# EAGLE schematic PATHS 1.1 (EAGLE 6.5.0)
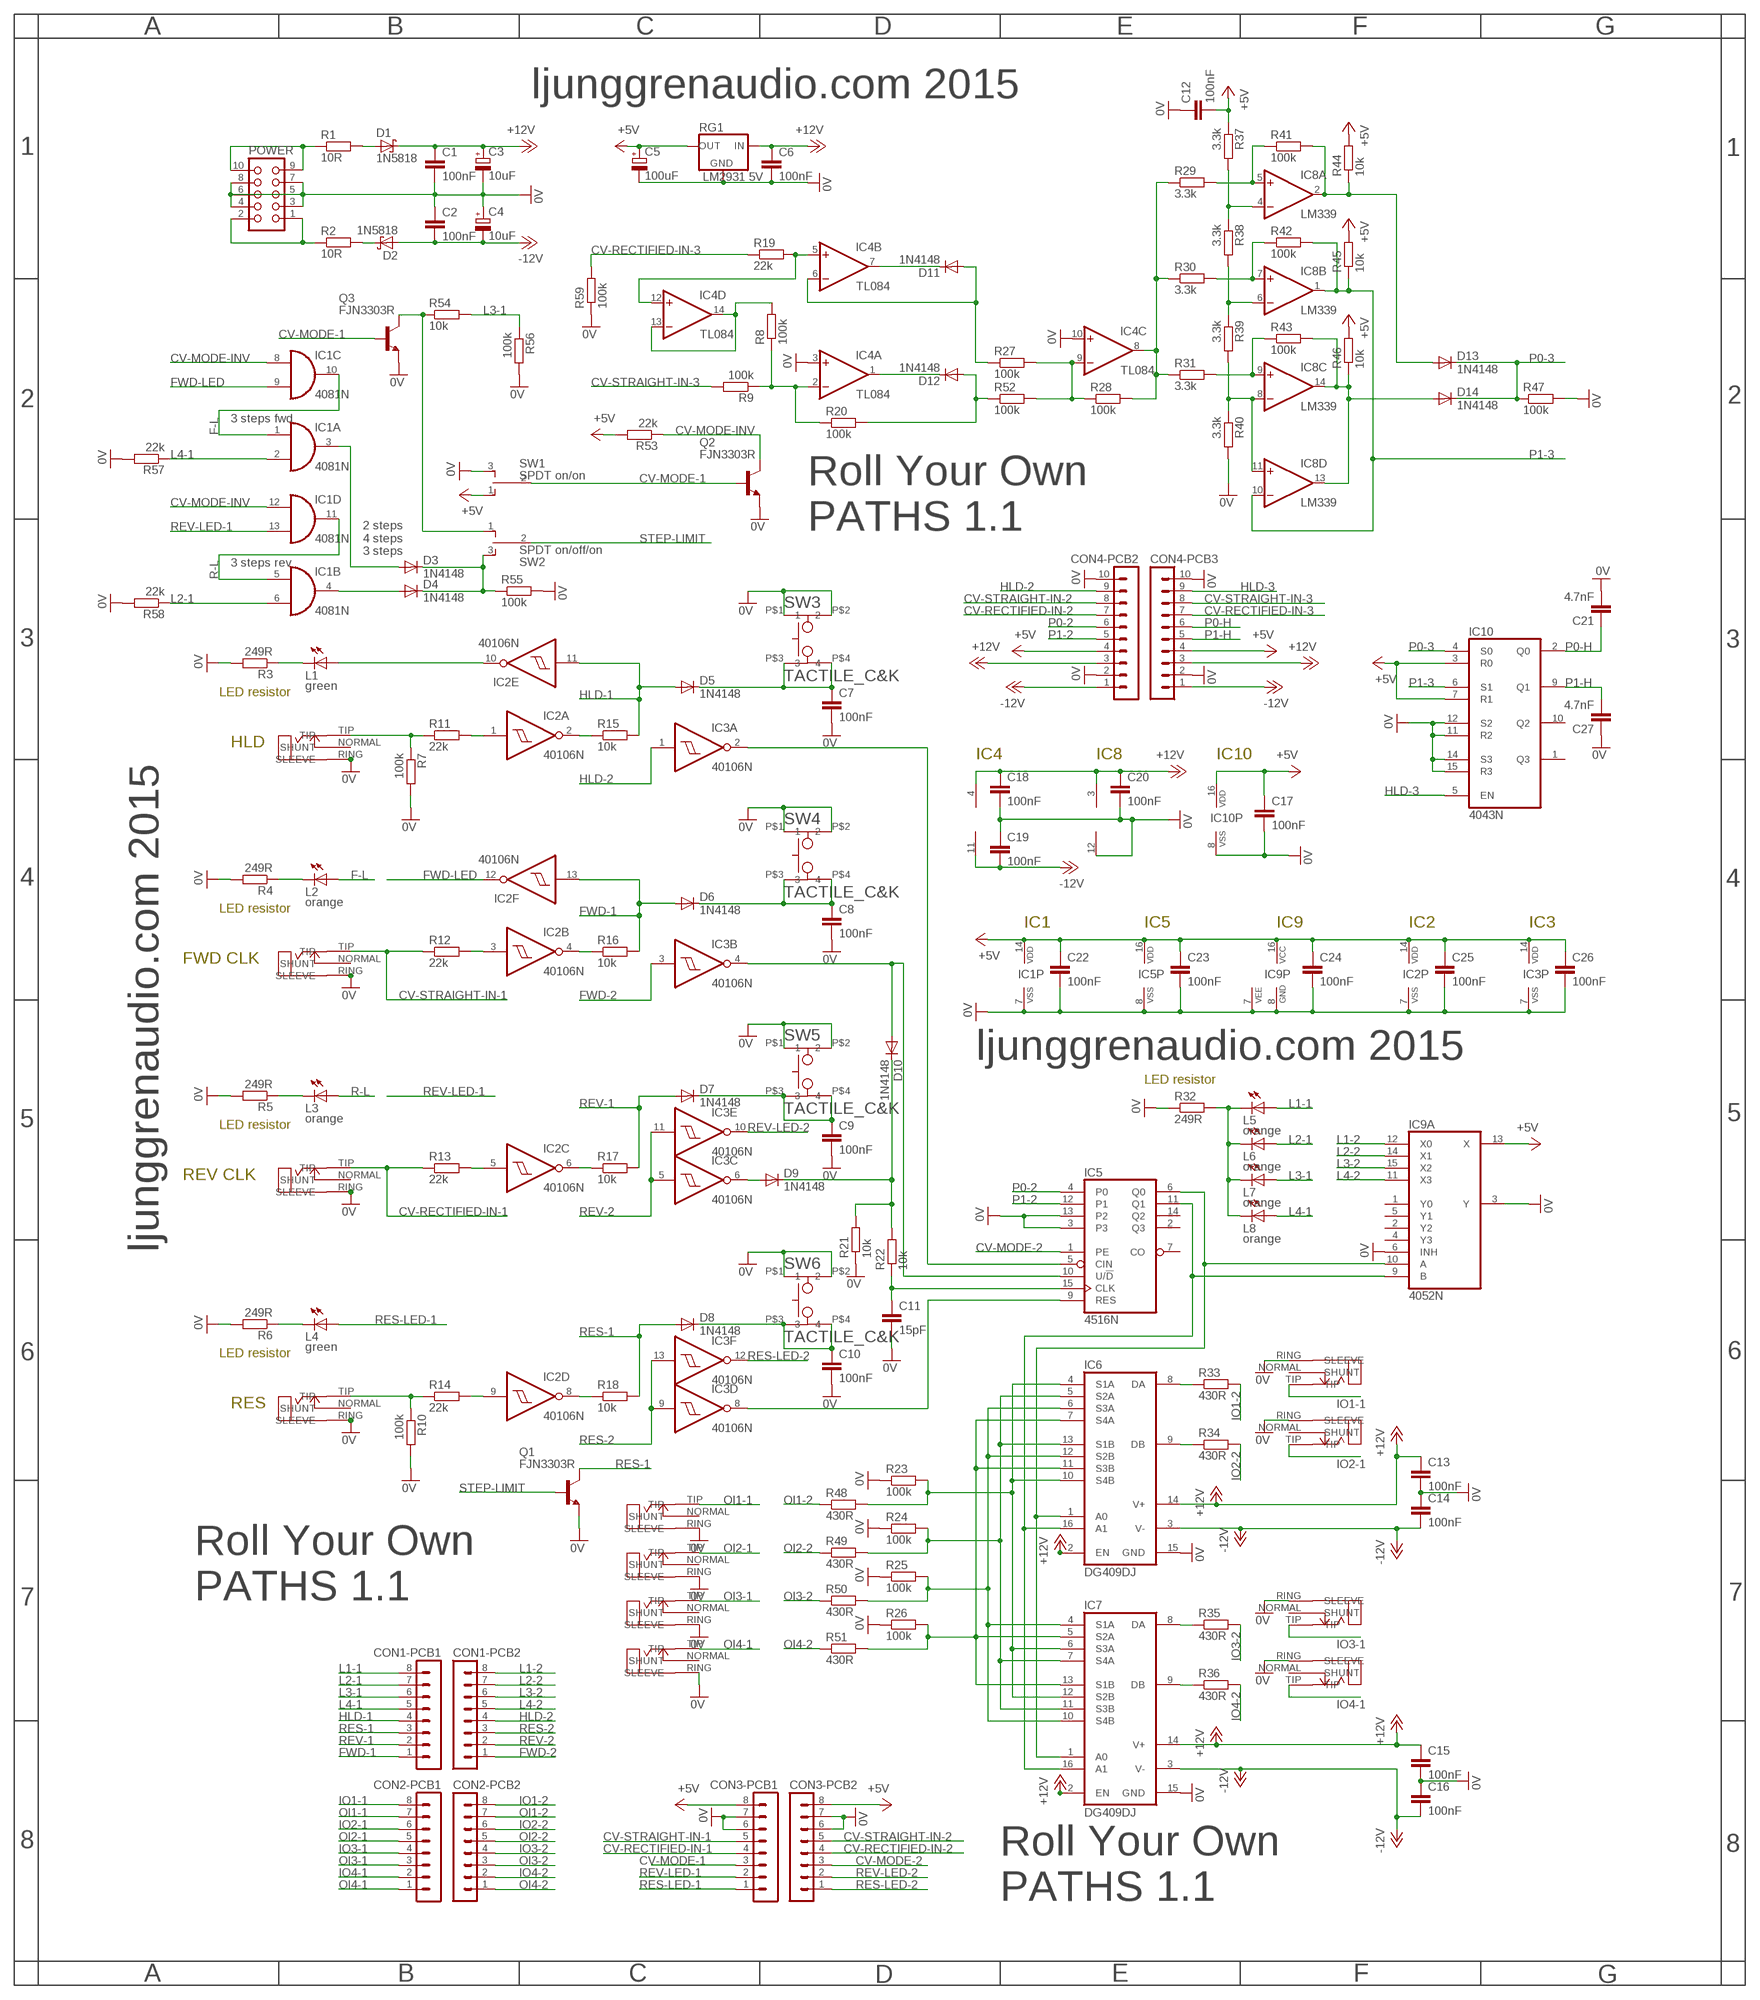
[diagram p0: schematic, sheet 1]

## Parts
C1  100nF  C-EU025-024X044  [C025-024X044]
C2  100nF  C-EU025-024X044  [C025-024X044]
C3  10uF  CPOL-EUE2-5  [E2-5]
C4  10uF  CPOL-EUE2-5  [E2-5]
C5  100uF  CPOL-EUE2.5-6  [E2,5-6]
C6  100nF  C-EU025-024X044  [C025-024X044]
C7  100nF  C-EU025-024X044  [C025-024X044]
C8  100nF  C-EU025-024X044  [C025-024X044]
C9  100nF  C-EU025-024X044  [C025-024X044]
C10  100nF  C-EU025-024X044  [C025-024X044]
C11  15pF  C-EU025-024X044  [C025-024X044]
C12  100nF  C-EU025-024X044  [C025-024X044]
C13  100nF  C-EU025-024X044  [C025-024X044]
C14  100nF  C-EU025-024X044  [C025-024X044]
C15  100nF  C-EU025-024X044  [C025-024X044]
C16  100nF  C-EU025-024X044  [C025-024X044]
C17  100nF  C-EU025-024X044  [C025-024X044]
C18  100nF  C-EU025-024X044  [C025-024X044]
C19  100nF  C-EU025-024X044  [C025-024X044]
C20  100nF  C-EU025-024X044  [C025-024X044]
C21  4.7nF  C-EU025-024X044  [C025-024X044]
C22  100nF  C-EU025-024X044  [C025-024X044]
C23  100nF  C-EU025-024X044  [C025-024X044]
C24  100nF  C-EU025-024X044  [C025-024X044]
C25  100nF  C-EU025-024X044  [C025-024X044]
C26  100nF  C-EU025-024X044  [C025-024X044]
C27  4.7nF  C-EU025-024X044  [C025-024X044]
CON1-PCB1  MA08-1  [MA08-1]
CON1-PCB2  MA08-1  [MA08-1]
CON2-PCB1  MA08-1  [MA08-1]
CON2-PCB2  MA08-1  [MA08-1]
CON3-PCB1  MA08-1  [MA08-1]
CON3-PCB2  MA08-1  [MA08-1]
CON4-PCB2  MA10-1  [MA10-1]
CON4-PCB3  MA10-1  [MA10-1]
D1  1N5818  SB130DO-204AL  [DO41-7]
D2  1N5818  SB130DO-204AL  [DO41-7]
D3  1N4148  1N4148DO35-6  [DO35-6]
D4  1N4148  1N4148DO35-6  [DO35-6]
D5  1N4148  1N4148DO35-6  [DO35-6]
D6  1N4148  1N4148DO35-6  [DO35-6]
D7  1N4148  1N4148DO35-6  [DO35-6]
D8  1N4148  1N4148DO35-6  [DO35-6]
D9  1N4148  1N4148DO35-6  [DO35-6]
D10  1N4148  1N4148DO35-6  [DO35-6]
D11  1N4148  1N4148DO35-6  [DO35-6]
D12  1N4148  1N4148DO35-6  [DO35-6]
D13  1N4148  1N4148DO35-6  [DO35-6]
D14  1N4148  1N4148DO35-6  [DO35-6]
FWD  ERTHENVAR_3.5MM_JACKINLINE2  [THONKICON-TWISTED]
HLD  ERTHENVAR_3.5MM_JACKINLINE2  [THONKICON-TWISTED]
I/O1  ERTHENVAR_3.5MM_JACKINLINE2  [THONKICON-TWISTED]
I/O2  ERTHENVAR_3.5MM_JACKINLINE2  [THONKICON-TWISTED]
I/O3  ERTHENVAR_3.5MM_JACKINLINE2  [THONKICON-TWISTED]
I/O4  ERTHENVAR_3.5MM_JACKINLINE2  [THONKICON-TWISTED]
IC1  4081N  [DIL14]
IC2  40106N  [DIL14]
IC3  40106N  [DIL14]
IC4  TL084  TL074P  [DIL14]
IC5  4516N  [DIL16]
IC6  DG409DJ  [DIL16]
IC7  DG409DJ  [DIL16]
IC8  LM339  LM2901N  [DIL14]
IC9  4052N  [DIL16]
IC10  4043N  [DIL16]
L1  green  LED3MM  [LED3MM]
L2  orange  LED3MM  [LED3MM]
L3  orange  LED3MM  [LED3MM]
L4  green  LED3MM  [LED3MM]
L5  orange  LED3MM  [LED3MM]
L6  orange  LED3MM  [LED3MM]
L7  orange  LED3MM  [LED3MM]
L8  orange  LED3MM  [LED3MM]
O/I1  ERTHENVAR_3.5MM_JACKINLINE2  [THONKICON-TWISTED]
O/I2  ERTHENVAR_3.5MM_JACKINLINE2  [THONKICON-TWISTED]
O/I3  ERTHENVAR_3.5MM_JACKINLINE2  [THONKICON-TWISTED]
O/I4  ERTHENVAR_3.5MM_JACKINLINE2  [THONKICON-TWISTED]
POWER  CON10L  [CON10L]
Q1  FJN3303R  [TO92-LINE]
Q2  FJN3303R  [TO92-LINE]
Q3  FJN3303R  [TO92-LINE]
R1  10R  R-EU_0207/10  [0207/9]
R2  10R  R-EU_0207/10  [0207/9]
R3  249R  R-EU_0204/5  [0204/5]
R4  249R  R-EU_0204/5  [0204/5]
R5  249R  R-EU_0204/5  [0204/5]
R6  249R  R-EU_0204/5  [0204/5]
R7  100k  R-EU_0204/5  [0204/5]
R8  100k  R-EU_0204/5  [0204/5]
R9  100k  R-EU_0204/5  [0204/5]
R10  100k  R-EU_0204/5  [0204/5]
R11  22k  R-EU_0204/5  [0204/5]
R12  22k  R-EU_0204/5  [0204/5]
R13  22k  R-EU_0204/5  [0204/5]
R14  22k  R-EU_0204/5  [0204/5]
R15  10k  R-EU_0204/5  [0204/5]
R16  10k  R-EU_0204/5  [0204/5]
R17  10k  R-EU_0204/5  [0204/5]
R18  10k  R-EU_0204/5  [0204/5]
R19  22k  R-EU_0204/5  [0204/5]
R20  100k  R-EU_0204/5  [0204/5]
R21  10k  R-EU_0204/5  [0204/5]
R22  10k  R-EU_0204/5  [0204/5]
R23  100k  R-EU_0204/5  [0204/5]
R24  100k  R-EU_0204/5  [0204/5]
R25  100k  R-EU_0204/5  [0204/5]
R26  100k  R-EU_0204/5  [0204/5]
R27  100k  R-EU_0204/5  [0204/5]
R28  100k  R-EU_0204/5  [0204/5]
R29  3.3k  R-EU_0204/5  [0204/5]
R30  3.3k  R-EU_0204/5  [0204/5]
R31  3.3k  R-EU_0204/5  [0204/5]
R32  249R  R-EU_0204/5  [0204/5]
R33  430R  R-EU_0207/10  [0207/9]
R34  430R  R-EU_0207/10  [0207/9]
R35  430R  R-EU_0207/10  [0207/9]
R36  430R  R-EU_0207/10  [0207/9]
R37  3.3k  R-EU_0204/5  [0204/5]
R38  3.3k  R-EU_0204/5  [0204/5]
R39  3.3k  R-EU_0204/5  [0204/5]
R40  3.3k  R-EU_0204/5  [0204/5]
R41  100k  R-EU_0204/5  [0204/5]
R42  100k  R-EU_0204/5  [0204/5]
R43  100k  R-EU_0204/5  [0204/5]
R44  10k  R-EU_0204/5  [0204/5]
R45  10k  R-EU_0204/5  [0204/5]
R46  10k  R-EU_0204/5  [0204/5]
R47  100k  R-EU_0204/5  [0204/5]
R48  430R  R-EU_0207/10  [0207/9]
R49  430R  R-EU_0207/10  [0207/9]
R50  430R  R-EU_0207/10  [0207/9]
R51  430R  R-EU_0207/10  [0207/9]
R52  100k  R-EU_0204/5  [0204/5]
R53  22k  R-EU_0204/5  [0204/5]
R54  10k  R-EU_0204/5  [0204/5]
R55  100k  R-EU_0204/5  [0204/5]
R56  100k  R-EU_0204/5  [0204/5]
R57  22k  R-EU_0204/5  [0204/5]
R58  22k  R-EU_0204/5  [0204/5]
R59  100k  R-EU_0204/5  [0204/5]
RES  ERTHENVAR_3.5MM_JACKINLINE2  [THONKICON-TWISTED]
REV  ERTHENVAR_3.5MM_JACKINLINE2  [THONKICON-TWISTED]
RG1  LM2931 5V  78LXXLM2931XXX  [TO92-LINE]
SW1  SPDT on/on  SPDTTOP-SUBMINI  [SPDT-HORIZONTAL-TOP-SUBMINI-MULTICOMP]
SW2  SPDT on/off/on  SPDTTOP-SUBMINI  [SPDT-HORIZONTAL-TOP-SUBMINI-MULTICOMP]
SW3  TACTILE_C&K  [TACTILE_CK]
SW4  TACTILE_C&K  [TACTILE_CK]
SW5  TACTILE_C&K  [TACTILE_CK]
SW6  TACTILE_C&K  [TACTILE_CK]

## Nets
0V: C1.2 C2.1 C3.- C4.+ C5.- C6.2 C7.2 C8.2 C9.2 C10.2 C11.2 C12.1 C13.2 C14.1 C15.2 C16.1 C17.2 C18.2 C19.1 C20.2 C21.2 C22.2 C23.2 C24.2 C25.2 C26.2 C27.1 CON3-PCB1.6 CON3-PCB1.7 CON3-PCB2.6 CON3-PCB2.7 CON4-PCB2.2 CON4-PCB2.10 CON4-PCB3.2 CON4-PCB3.10 FWD.RING(SLEEVE) HLD.RING(SLEEVE) I/O1.RING(SLEEVE) I/O2.RING(SLEEVE) I/O3.RING(SLEEVE) I/O4.RING(SLEEVE) IC1.7(P:VSS) IC2.7(P:VSS) IC3.7(P:VSS) IC4.3(A:+IN) IC4.10(C:+IN) IC5.3 IC5.8(VSS) IC5.13(P2) IC6.15(GND) IC7.15(GND) IC8.12(P:V-) IC9.3(A:Y) IC9.6(A:INH) IC9.7(P:VEE) IC9.8(P:GND) IC10.8(VSS) IC10.11(R2) IC10.12(S2) IC10.14(S3) IC10.15(R3) O/I1.RING(SLEEVE) O/I2.RING(SLEEVE) O/I3.RING(SLEEVE) O/I4.RING(SLEEVE) POWER.3 POWER.4 POWER.5 POWER.6 POWER.7 POWER.8 Q1.3(E) Q2.3(E) Q3.3(E) R3.2 R4.2 R5.2 R6.2 R7.2 R10.2 R21.1 R23.1 R24.1 R25.1 R26.1 R32.1 R40.2 R47.2 R55.2 R56.2 R57.2 R58.2 R59.1 RES.RING(SLEEVE) REV.RING(SLEEVE) RG1.2(GND) SW1.3 SW3.P$1 SW3.P$2 SW4.P$1 SW4.P$2 SW5.P$1 SW5.P$2 SW6.P$1 SW6.P$2
+5V: C5.+ C12.2 C17.1 C22.1 C23.1 C24.1 C25.1 C26.1 CON3-PCB1.8 CON3-PCB2.8 CON4-PCB2.4 CON4-PCB3.4 IC1.14(P:VDD) IC2.14(P:VDD) IC3.14(P:VDD) IC5.16(VDD) IC9.13(A:X) IC9.16(P:VCC) IC10.3(R0) IC10.7(R1) IC10.16(VDD) R37.1 R44.2 R45.2 R46.2 R53.2 RG1.3(OUT) SW1.1
+12V: C1.1 C3.+ C6.1 C13.1 C15.1 C18.1 C20.1 CON4-PCB2.3 CON4-PCB3.3 D1.C IC4.4(P:V+) IC6.2(EN) IC6.14(V+) IC7.2(EN) IC7.14(V+) IC8.3(P:V+) RG1.1(IN)
-12V: C2.2 C4.- C14.2 C16.2 C19.2 CON4-PCB2.1 CON4-PCB3.1 D2.A IC4.11(P:V-) IC6.3(V-) IC7.3(V-)
BDF3R2T: C9.1 D7.CATHODE(C) SW5.P$3 SW5.P$4
CV-MODE-1: CON3-PCB1.3 Q2.1(B) Q3.1(B) SW1.2
CV-MODE-2: CON3-PCB2.3 IC5.1(PE)
CV-MODE-INV: IC1.8(C:I0) IC1.12(D:I0) Q2.2(C) R53.1
CV-RECTIFIED-IN-1: CON3-PCB1.4 R13.1 REV.TIP
CV-RECTIFIED-IN-2: CON3-PCB2.4 CON4-PCB2.7
CV-RECTIFIED-IN-3: CON4-PCB3.7 R19.1 R59.2
CV-STRAIGHT-IN-1: CON3-PCB1.5 FWD.TIP R12.1
CV-STRAIGHT-IN-2: CON3-PCB2.5 CON4-PCB2.8
CV-STRAIGHT-IN-3: CON4-PCB3.8 R9.2
DFGT43: C8.1 D6.CATHODE(C) SW4.P$3 SW4.P$4
DVW4D: D9.ANODE(A) IC3.6(C:O)
F-L: IC1.1(A:I0) IC1.10(C:O) L2.A
FGDFS33: IC3.2(A:O) IC5.5(CIN)
FSS44F: IC3.8(D:O) IC5.9(RES)
FWD-1: CON1-PCB1.1 D6.ANODE(A) IC2.13(F:I) R16.2
FWD-2: CON1-PCB2.1 IC3.3(B:I)
FWD-LED: IC1.9(C:I1) IC2.12(F:O)
HLD-1: CON1-PCB1.4 D5.ANODE(A) IC2.11(E:I) R15.2
HLD-2: CON1-PCB2.4 CON4-PCB2.9 IC3.1(A:I)
HLD-3: CON4-PCB3.9 IC10.5(EN)
IO1-1: CON2-PCB1.8 I/O1.TIP
IO1-2: CON2-PCB2.8 R33.2
IO2-1: CON2-PCB1.6 I/O2.TIP
IO2-2: CON2-PCB2.6 R34.2
IO3-1: CON2-PCB1.4 I/O3.TIP
IO3-2: CON2-PCB2.4 R35.2
IO4-1: CON2-PCB1.2 I/O4.TIP
IO4-2: CON2-PCB2.2 R36.2
L1-1: CON1-PCB1.8 L5.A
L1-2: CON1-PCB2.8 IC9.12(A:X0)
L2-1: CON1-PCB1.7 IC1.6(B:I1) L6.A R58.1
L2-2: CON1-PCB2.7 IC9.14(A:X1)
L3-1: CON1-PCB1.6 L7.A R54.2 R56.1
L3-2: CON1-PCB2.6 IC9.15(A:X2)
L4-1: CON1-PCB1.5 IC1.2(A:I1) L8.A R57.1
L4-2: CON1-PCB2.5 IC9.11(A:X3)
N$1: IC5.11(Q1) IC6.16(A1) IC7.16(A1) IC9.9(A:B)
N$2: IC5.6(Q0) IC6.1(A0) IC7.1(A0) IC9.10(A:A)
N$3: IC2.3(B:I) R12.2
N$4: C11.1 IC5.15(CLK) R22.1
N$5: IC6.9(DB) R34.1
N$6: IC7.9(DB) R36.1
N$7: L2.K(C) R4.1
N$8: HLD.TIP R7.1 R11.1
N$9: IC7.8(DA) R35.1
N$10: IC2.4(B:O) R16.1
N$11: IC2.6(C:O) R17.1
N$12: R10.1 R14.1 RES.TIP
N$13: IC6.8(DA) R33.1
N$14: L1.K(C) R3.1
N$15: L3.K(C) R5.1
N$16: IC2.8(D:O) R18.1
N$17: C10.1 D8.CATHODE(C) SW6.P$3 SW6.P$4
N$18: IC2.10(E:O) L1.A
N$19: D3.ANODE(A) IC1.3(A:O)
N$20: L4.K(C) R6.1
N$21: IC2.5(C:I) R13.2
N$22: POWER.1 POWER.2 R2.1
N$23: POWER.9 POWER.10 R1.1
N$24: D1.A R1.2
N$25: D2.C R2.2
N$26: IC2.9(D:I) R14.2
N$27: IC2.2(A:O) R15.1
N$28: C7.1 D5.CATHODE(C) SW3.P$3 SW3.P$4
N$29: IC4.2(A:-IN) R8.1 R9.1 R20.1
N$30: D4.ANODE(A) IC1.4(B:O)
N$32: IC8.4(A:-IN) R37.2 R38.1
N$33: IC8.6(B:-IN) R38.2 R39.1
N$34: IC8.8(C:-IN) IC8.11(D:+IN) R39.2 R40.1
N$35: D11.ANODE(A) IC4.6(B:-IN) R27.1
N$36: IC8.9(C:+IN) R31.2 R43.1
N$37: IC8.7(B:+IN) R30.2 R42.1
N$38: IC8.5(A:+IN) R29.2 R41.1
N$39: D9.CATHODE(C) D10.CATHODE(C) R21.2 R22.2
N$40: L5.K(C) L6.K(C) L7.K(C) L8.K(C) R32.2
N$41: D14.ANODE(A) IC8.13(D:OUT) IC8.14(C:OUT) R43.2 R46.1
N$42: IC6.6(S3A) IC6.12(S2B) IC7.4(S1A) IC7.10(S4B) R25.2 R50.2
N$43: D13.ANODE(A) IC8.2(A:OUT) R41.2 R44.1
N$45: IC4.5(B:+IN) IC4.12(D:+IN) R19.2
N$46: D11.CATHODE(C) IC4.7(B:OUT)
N$47: D3.CATHODE(C) D4.CATHODE(C) R55.1 SW2.3
N$48: IC6.7(S4A) IC6.11(S3B) IC7.5(S2A) IC7.13(S1B) R26.2 R51.2
N$51: IC2.1(A:I) R11.2
N$52: D12.CATHODE(C) IC4.1(A:OUT)
N$53: IC4.9(C:-IN) R27.2 R28.1 R52.2
N$54: IC4.8(C:OUT) R28.2 R29.1 R30.1 R31.1
N$56: IC6.5(S2A) IC6.13(S1B) IC7.7(S4A) IC7.11(S3B) R24.2 R49.2
N$57: IC6.4(S1A) IC6.10(S4B) IC7.6(S3A) IC7.12(S2B) R23.2 R48.2
N$58: IC4.13(D:-IN) IC4.14(D:OUT) R8.2
N$59: D12.ANODE(A) R20.2 R52.1
N$60: Q3.2(C) R54.1 SW2.1
OI1-1: CON2-PCB1.7 O/I1.TIP
OI1-2: CON2-PCB2.7 R48.1
OI2-1: CON2-PCB1.5 O/I2.TIP
OI2-2: CON2-PCB2.5 R49.1
OI3-1: CON2-PCB1.3 O/I3.TIP
OI3-2: CON2-PCB2.3 R50.1
OI4-1: CON2-PCB1.1 O/I4.TIP
OI4-2: CON2-PCB2.1 R51.1
P0-2: CON4-PCB2.6 IC5.4(P0)
P0-3: D13.CATHODE(C) D14.CATHODE(C) IC10.4(S0) R47.1
P0-H: C21.1 CON4-PCB3.6 IC10.2(Q0)
P1-2: CON4-PCB2.5 IC5.12(P1)
P1-3: IC8.1(B:OUT) IC8.10(D:-IN) IC10.6(S1) R42.2 R45.1
P1-H: C27.2 CON4-PCB3.5 IC10.9(Q1)
R-L: IC1.5(B:I0) IC1.11(D:O) L3.A
RES-1: CON1-PCB1.3 D8.ANODE(A) Q1.2(C) R18.2
RES-2: CON1-PCB2.3 IC3.9(D:I) IC3.13(F:I)
RES-LED-1: CON3-PCB1.1 L4.A
RES-LED-2: CON3-PCB2.1 IC3.12(F:O)
REV-1: CON1-PCB1.2 D7.ANODE(A) R17.2
REV-2: CON1-PCB2.2 IC3.5(C:I) IC3.11(E:I)
REV-LED-1: CON3-PCB1.2 IC1.13(D:I1)
REV-LED-2: CON3-PCB2.2 IC3.10(E:O)
STEP-LIMIT: Q1.1(B) SW2.2
XBGE4: D10.ANODE(A) IC3.4(B:O) IC5.10(U/!D)
Unconnected: FWD.NORMAL(SHUNT) HLD.NORMAL(SHUNT) I/O1.NORMAL(SHUNT) I/O2.NORMAL(SHUNT) I/O3.NORMAL(SHUNT) I/O4.NORMAL(SHUNT) IC5.2(Q3) IC5.7(CO) IC5.14(Q2) IC9.1(A:Y0) IC9.2(A:Y2) IC9.4(A:Y3) IC9.5(A:Y1) IC10.1(Q3) IC10.10(Q2) O/I1.NORMAL(SHUNT) O/I2.NORMAL(SHUNT) O/I3.NORMAL(SHUNT) O/I4.NORMAL(SHUNT) RES.NORMAL(SHUNT) REV.NORMAL(SHUNT)

## Notes on the sheet
- A | B | C | D | E | F | G
- ljunggrenaudio.com 2015
- 1 | 1
- 2 | 2
- 3 steps fwd
- Roll Your Own
  PATHS 1.1
- 2 steps
  4 steps
  3 steps
- 3 steps rev
- 3 | 3
- LED resistor
- HLD
- IC4 | IC8 | IC10
- 4 | 4
- LED resistor
- IC1 | IC5 | IC9 | IC2 | IC3
- FWD CLK
- ljunggrenaudio.com 2015
- LED resistor
- LED resistor | 5
- 5
- REV CLK
- ljunggrenaudio.com 2015
- LED resistor
- 6 | 6
- RES
- Roll Your Own
  PATHS 1.1
- 7 | 7
- 8 | 8
- Roll Your Own
  PATHS 1.1
- A | B | C | D | E | F | G

## Library data of the parts
C1 C2 C6-C27 = Roll Your Own:C-EU: CAPACITOR, European symbol
C3-C5 = Roll Your Own:CPOL-EU: POLARIZED CAPACITOR, European symbol
CON1-PCB1 CON1-PCB2 CON2-PCB1 CON2-PCB2 CON3-PCB1 CON3-PCB2 = Roll Your Own:MA08-1: PIN HEADER; OC_FARNELL: unknown; OC_NEWARK: unknown
CON4-PCB2 CON4-PCB3 = Roll Your Own:MA10-1: PIN HEADER; OC_FARNELL: unknown; OC_NEWARK: unknown
D1 D2 = Roll Your Own:SB130
D3-D14 = Roll Your Own:1N4148: DIODE high speed (Philips)
FWD HLD I/O1-I/O4 O/I1-O/I4 RES REV = Roll Your Own:ERTHENVAR_3.5MM_JACK
IC1 = Roll Your Own:4081: Quad 2-input AND
IC2 IC3 = Roll Your Own:40106: Hex SCHMITT TRIGGER
IC4 = Roll Your Own:TL074: OP AMP
IC5 = Roll Your Own:4516: Binary up down COUNTER
IC6 IC7 = maxim:DG409DJ: ANALOG MULTIPLEXER; MF: INTERSIL; MPN: DG409DJ; OC_FARNELL: 9664084; OC_NEWARK: 06F3963
IC8 = Roll Your Own:LM2901: COMPARATOR
IC9 = Roll Your Own:4052: Dual 4-channel ANALOG MULTIPLEXER
IC10 = Roll Your Own:4043: Quad 3-state NOR R/S LATCH
L1-L8 = Roll Your Own:LED: LED OSRAM: - CHIPLED LG R971, LG N971, LY N971, LG Q971, LY Q971, LO R971, LY R971 LH N974, LH R974 LS Q976, LO Q976, LY Q976 LO Q996 - Hyper CHIPLED LW Q18S LB Q993, LB Q99A, LB R99A - SideLED LS A670, LO A670, LY A670, LG A670, LP A670 LB A673, LV A673, LT A673, LW A673 LH A674 LY A675 LS A676, LA A676, LO A676, LY A676, LW A676 LS A679, LY A679, LG A679 - Hyper Micro SIDELED® LS Y876, LA Y876, LO Y876, LY Y876 LT Y87S - SmartLED LW L88C, LW L88S LB L89C, LB L89S, LG L890 LS L89K, LO L89K, LY L89K LS L896, LA L896, LO L896, LY L896 - TOPLED LS T670, LO T670, LY T670, LG T670, LP T670 LSG T670, LSP T670, LSY T670, LOP T670, LYG T670 LG T671, LOG T671, LSG T671 LB T673, LV T673, LT T673, LW T673 LH T674 LS T676, LA T676, LO T676, LY T676, LB T676, LH T676, LSB T676, LW T676 LB T67C, LV T67C, LT T67C, LS T67K, LO T67K, LY T67K, LW E67C LS E67B, LA E67B, LO E67B, LY E67B, LB E67C, LV E67C, LT E67C LW T67C LS T679, LY T679, LG T679 LS T770, LO T770, LY T770, LG T770, LP T770 LB T773, LV T773, LT T773, LW T773 LH T774 LS E675, LA E675, LY E675, LS T675 LS T776, LA T776, LO T776, LY T776, LB T776 LHGB T686 LT T68C, LB T68C - Hyper Mini TOPLED® LB M676 - Mini TOPLED Santana® LG M470 LS M47K, LO M47K, LY M47K Source: http://www.osram.convergy.de LUXEON: - LUMILED® LXK2-PW12-R00, LXK2-PW12-S00, LXK2-PW14-U00, LXK2-PW14-V00 LXK2-PM12-R00, LXK2-PM12-S00, LXK2-PM14-U00 LXK2-PE12-Q00, LXK2-PE12-R00, LXK2-PE12-S00, LXK2-PE14-T00, LXK2-PE14-U00 LXK2-PB12-K00, LXK2-PB12-L00, LXK2-PB12-M00, LXK2-PB14-N00, LXK2-PB14-P00, LXK2-PB14-Q00 LXK2-PR12-L00, LXK2-PR12-M00, LXK2-PR14-Q00, LXK2-PR14-R00 LXK2-PD12-Q00, LXK2-PD12-R00, LXK2-PD12-S00 LXK2-PH12-R00, LXK2-PH12-S00 LXK2-PL12-P00, LXK2-PL12-Q00, LXK2-PL12-R00 Source: www.luxeon.com KINGBRIGHT: KA-3528ASYC Source: www.kingbright.com
POWER = Roll Your Own:CON10L: CONNECTOR; OC_FARNELL: unknown; OC_NEWARK: unknown
Q1-Q3 = Roll Your Own:FJN3303R
R1-R59 = Roll Your Own:R-EU_: RESISTOR, European symbol
RG1 = Roll Your Own:78LXX: VOLTAGE REGULATOR
SW1 SW2 = Roll Your Own:SPDT: Horizontal SPDT switch in the center-off position.
SW3-SW6 = Roll Your Own:TACTILE_C&K